# Altium schematic sheet LCT M3 SCH.SchDoc
size 559 x 498 mm
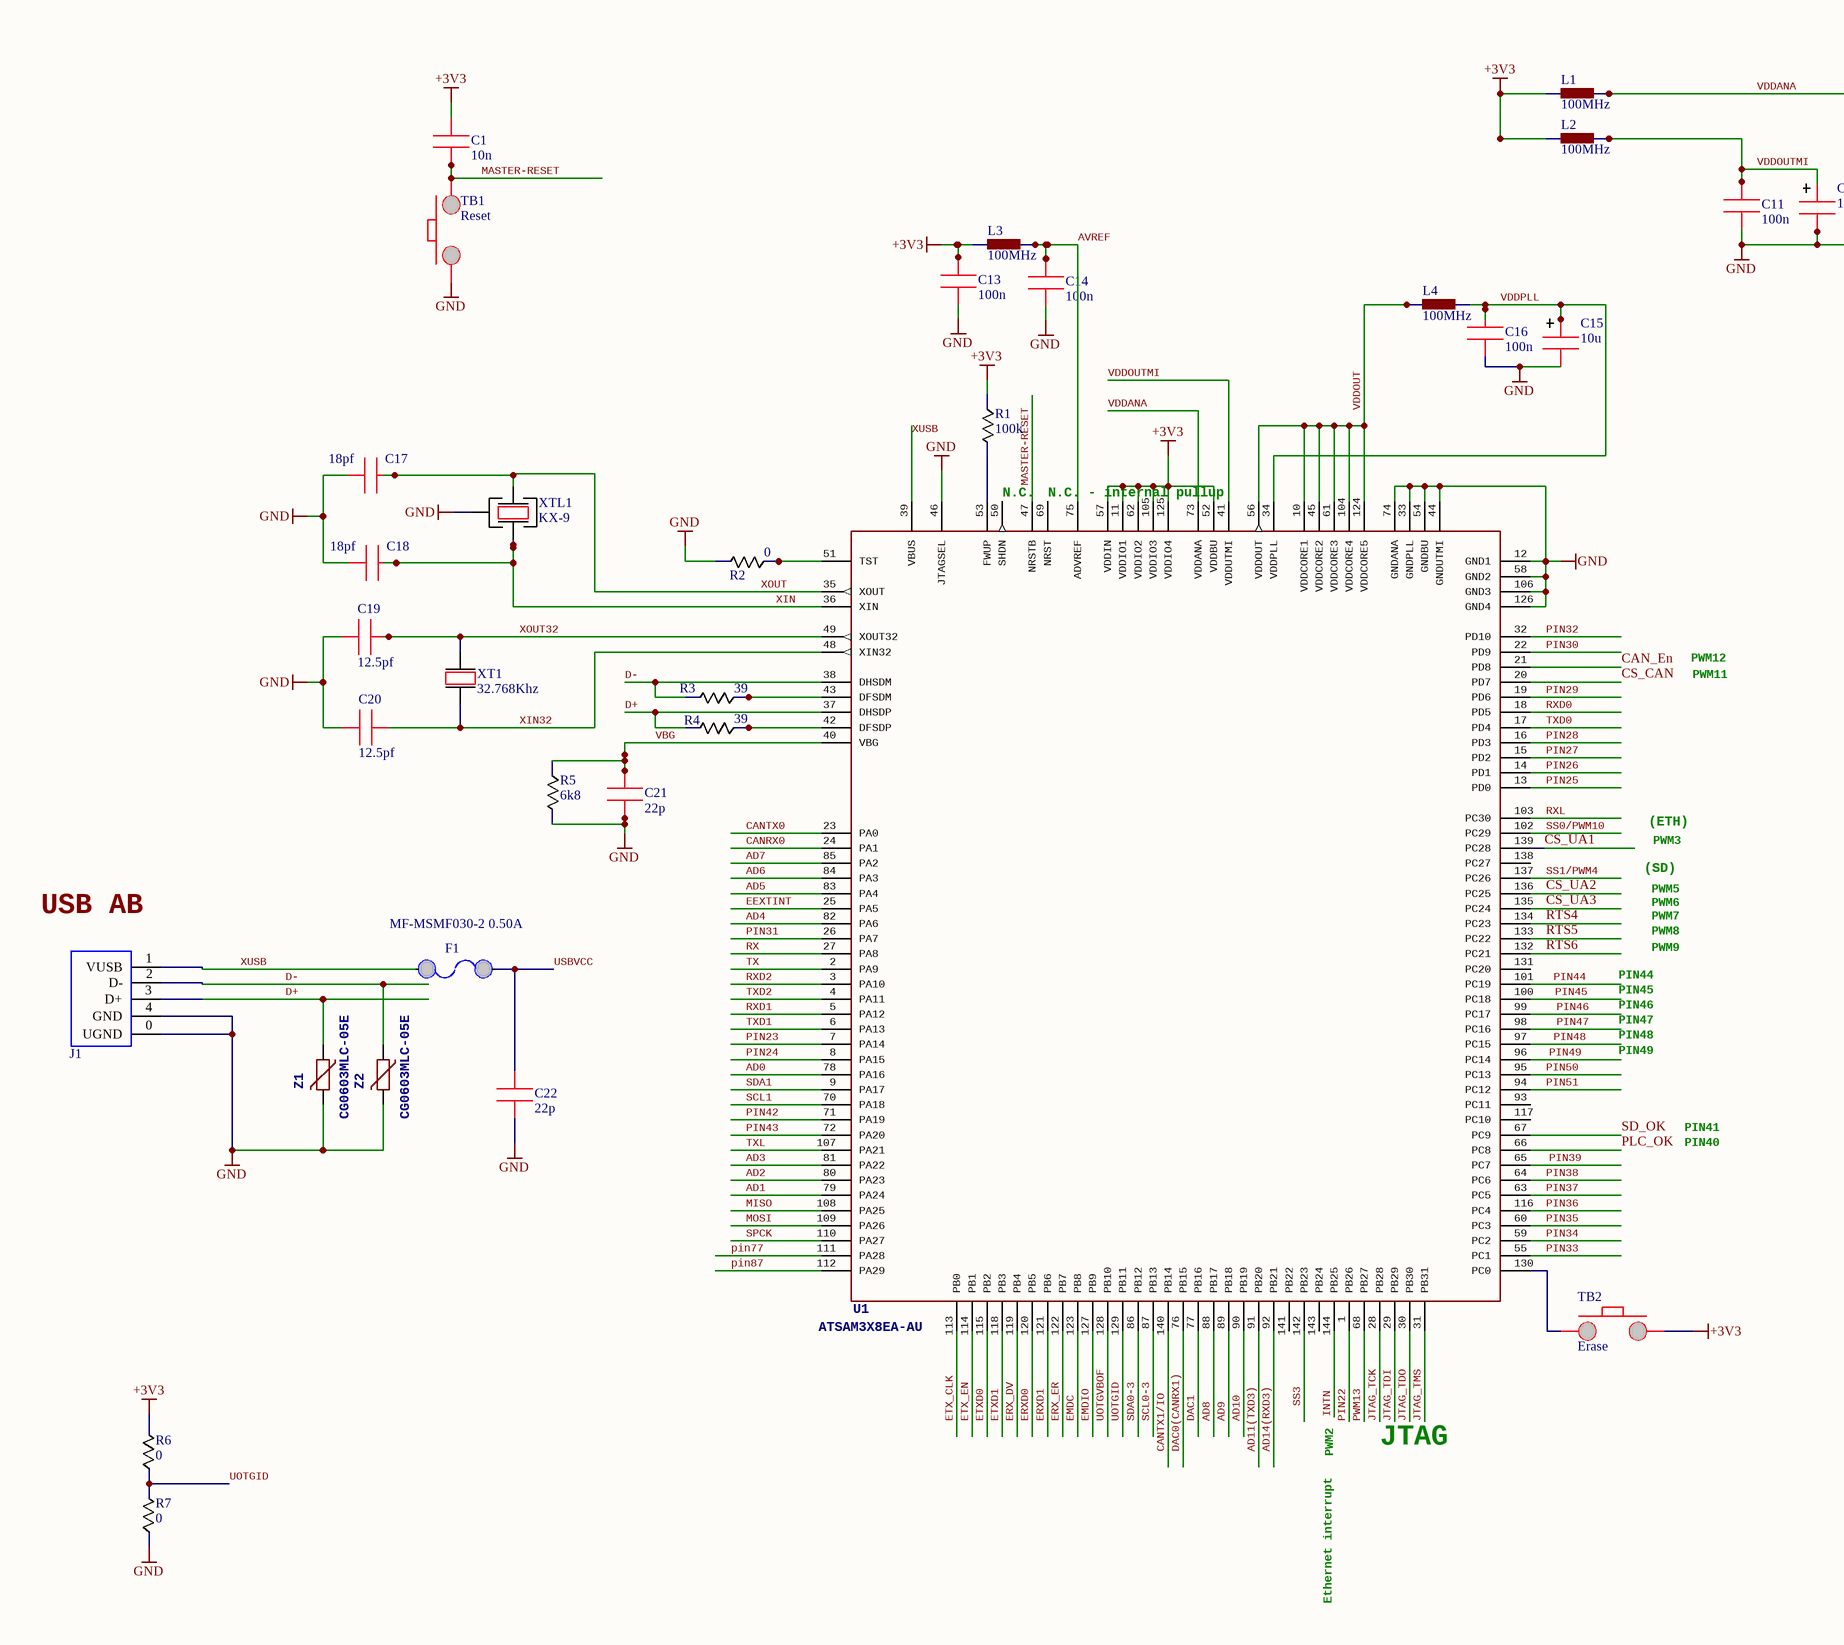
[diagram p0: LCT M3 SCH.SchDoc, left]
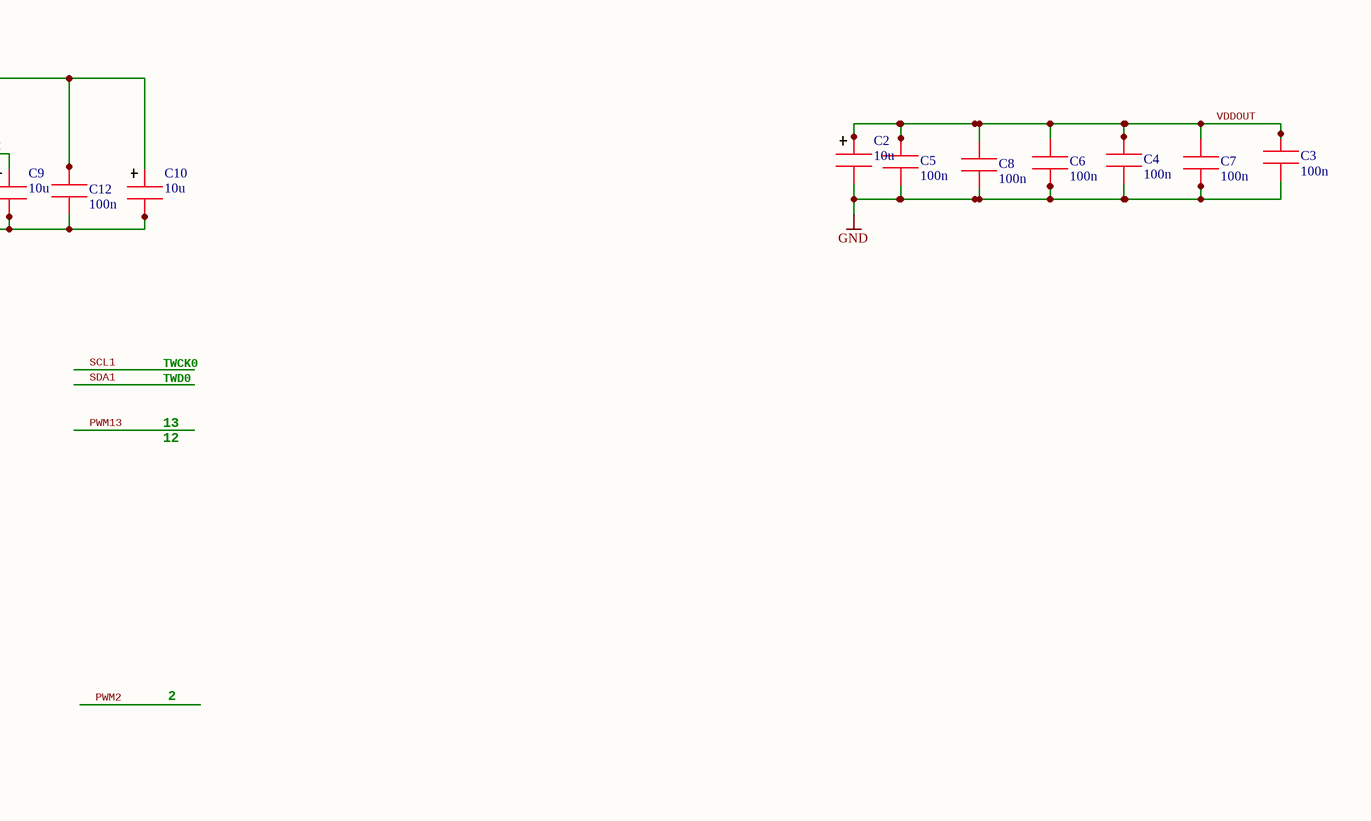
[diagram p1: LCT M3 SCH.SchDoc, right]

## Parts
C1  10n  [0603]
C2  10u  [1206]
C3  100n  [0603]
C4  100n  [0603]
C5  100n  [0603]
C6  100n  [0603]
C7  100n  [0603]
C8  100n  [0603]
C9  10u  [1206]
C10  10u  [1206]
C11  100n  [0603]
C12  100n  [0603]
C13  100n  [0603]
C14  100n  [0603]
C15  10u  [1206]
C16  100n  [0603]
C17  18pf  [0603]
C18  18pf  [0603]
C19  12.5pf  [0603]
C20  12.5pf  [0603]
C21  22p  [0603]
C22  22p  [0603]
F1  MF-MSMF030-2 0.50A  [Fuse PTS]
J1  USBB-1J  [USB B]  (value not drawn)
L1  100MHz  [0805]
L2  100MHz  [0805]
L3  100MHz  [0805]
L4  100MHz  [0805]
R1  100k  [0603]
R2  0  [0603]
R3  39  [0603]
R4  39  [0603]
R5  6k8  [0603]
R6  0  [0603]
R7  0  [0603]
TB1  Reset  [IT-1184-160G-g]
TB2  Erase  [IT-1184-160G-g]
U1  ATSAM3X8EA-AU  [LQFP144]
XT1  32.768Khz  [KX – 327]
XTL1  KX-9  [KX-9]
Z1  CG0603MLC-05E  [0603]
Z2  CG0603MLC-05E  [0603]

## Nets
+3V3: C1.2 C13.2 L1.1 L2.1 L3.1 R1.1 R6.2 TB2.1 U1.11(VDDIO1) U1.52(VDDBU) U1.57(VDDIN) U1.62(VDDIO2) U1.105(VDDIO3) U1.125(VDDIO4)
GND: C2.2 C3.1 C4.1 C5.1 C6.1 C7.1 C8.1 C9.2 C10.2 C11.1 C12.1 C13.1 C14.1 C15.2 C16.1 C17.1 C18.1 C19.2 C20.2 C21.1 C22.2 J1.0(UGND) J1.4(GND) R2.2 R5.2 R7.1 TB1.2 U1.12(GND1) U1.33(GNDPLL) U1.44(GNDUTMI) U1.46(JTAGSEL) U1.54(GNDBU) U1.58(GND2) U1.74(GNDANA) U1.106(GND3) U1.126(GND4) XTL1.g Z1.2 Z2.2
AD0: U1.78(PA16)
AD1: U1.79(PA24)
AD2: U1.80(PA23)
AD3: U1.81(PA22)
AD4: U1.82(PA6)
AD5: U1.83(PA4)
AD6: U1.84(PA3)
AD7: U1.85(PA2)
AD8: U1.88(PB17)
AD9: U1.89(PB18)
AD10: U1.90(PB19)
AD11(TXD3): U1.91(PB20)
AD14(RXD3): U1.92(PB21)
AVREF: C14.2 L3.2 U1.75(ADVREF)
CAN_En: U1.21(PD8)
CANRX0: U1.24(PA1)
CANTX0: U1.23(PA0)
CANTX1/IO: U1.140(PB14)
CS_CAN: U1.20(PD7)
CS_UA1: U1.139(PC28)
CS_UA2: U1.136(PC25)
CS_UA3: U1.135(PC24)
D+: J1.3(D+) R4.2 U1.37(DHSDP) Z1.1
D-: J1.2(D-) R3.2 U1.38(DHSDM) Z2.1
DAC0(CANRX1): U1.76(PB15)
DAC1: U1.77(PB16)
EEXTINT: U1.25(PA5)
EMDC: U1.123(PB8)
EMDIO: U1.127(PB9)
ERX_DV: U1.119(PB4)
ERX_ER: U1.122(PB7)
ERXD0: U1.120(PB5)
ERXD1: U1.121(PB6)
ETX_CLK: U1.113(PB0)
ETX_EN: U1.114(PB1)
ETXD0: U1.115(PB2)
ETXD1: U1.118(PB3)
INTN: U1.144(PB25)
JTAG_TCK: U1.28(PB28)
JTAG_TDI: U1.29(PB29)
JTAG_TDO: U1.30(PB30)
JTAG_TMS: U1.31(PB31)
MASTER-RESET: C1.1 TB1.1 U1.47(NRSTB)
MISO: U1.108(PA25)
MOSI: U1.109(PA26)
PIN22: U1.1(PB26)
PIN23: U1.7(PA14)
PIN24: U1.8(PA15)
PIN25: U1.13(PD0)
PIN26: U1.14(PD1)
PIN27: U1.15(PD2)
PIN28: U1.16(PD3)
PIN29: U1.19(PD6)
PIN30: U1.22(PD9)
PIN31: U1.26(PA7)
PIN32: U1.32(PD10)
PIN33: U1.55(PC1)
PIN34: U1.59(PC2)
PIN35: U1.60(PC3)
PIN36: U1.116(PC4)
PIN37: U1.63(PC5)
PIN38: U1.64(PC6)
PIN39: U1.65(PC7)
PIN42: U1.71(PA19)
PIN43: U1.72(PA20)
PIN44: U1.101(PC19)
PIN45: U1.100(PC18)
PIN46: U1.99(PC17)
PIN47: U1.98(PC16)
PIN48: U1.97(PC15)
PIN49: U1.96(PC14)
PIN50: U1.95(PC13)
PIN51: U1.94(PC12)
pin77: U1.111(PA28)
pin87: U1.112(PA29)
PLC_OK: U1.66(PC8)
PWM13: U1.68(PB27)
RTS4: U1.134(PC23)
RTS5: U1.133(PC22)
RTS6: U1.132(PC21)
RX: U1.27(PA8)
RXD0: U1.18(PD5)
RXD1: U1.5(PA12)
RXD2: U1.3(PA10)
RXL: U1.103(PC30)
SCL0-3: U1.87(PB13)
SCL1: U1.70(PA18)
SD_OK: U1.67(PC9)
SDA0-3: U1.86(PB12)
SDA1: U1.9(PA17)
SPCK: U1.110(PA27)
SS0/PWM10: U1.102(PC29)
SS1/PWM4: U1.137(PC26)
SS3: U1.142(PB23)
TX: U1.2(PA9)
TXD0: U1.17(PD4)
TXD1: U1.6(PA13)
TXD2: U1.4(PA11)
TXL: U1.107(PA21)
UOTGID: R6.1 R7.2 U1.129(PB11)
UOTGVBOF: U1.128(PB10)
USBVCC: C22.1 F1.1
VBG: C21.2 R5.1 U1.40(VBG)
VDDANA: C10.1 C12.2 L1.2 U1.73(VDDANA)
VDDOUT: C2.1 C3.2 C4.2 C5.2 C6.2 C7.2 C8.2 L4.1 U1.10(VDDCORE1) U1.45(VDDCORE2) U1.56(VDDOUT) U1.61(VDDCORE3) U1.104(VDDCORE4) U1.124(VDDCORE5)
VDDOUTMI: C9.1 C11.2 L2.2 U1.41(VDDUTMI)
VDDPLL: C15.1 C16.2 L4.2 U1.34(VDDPLL)
XIN: C18.2 U1.36(XIN) XTL1.3
XIN32: C20.1 U1.48(XIN32) XT1.1
XOUT: C17.2 U1.35(XOUT) XTL1.1
XOUT32: C19.1 U1.49(XOUT32) XT1.2
XUSB: F1.2 J1.1(VUSB) U1.39(VBUS)
NetR1_2: R1.2 U1.53(FWUP)
NetR2_1: R2.1 U1.51(TST)
NetR3_1: R3.1 U1.43(DFSDM)
NetR4_1: R4.1 U1.42(DFSDP)
NetTB2_2: TB2.2 U1.130(PC0)

Not connected (* = marked no-connect by the designer): U1 50(SHDN) 69(NRST) 93(PC11) 117(PC10) 131(PC20) 138(PC27) 141(PB22) 143(PB24)

## Notes on the sheet
- 13
- TWCK0
- TWD0
- N.C.
- (near U1) N.C. - internal pullup
- 12
- PWM12
- PWM11
- 2
- (SD)
- (ETH)
- PWM5
- PWM3
- (near J1) USB AB
- PWM6
- PWM7
- PWM8
- PWM9
- PIN44
- PIN46
- PIN47
- PIN48
- PIN45
- PIN49
- PIN41
- PIN40
- PWM2
- JTAG
- Ethernet interrupt

## Library data of the parts
C1 C3-C8 C11-C14 C16-C22 = Capasitor 0805
C2 C9 C10 C15 = 1206 Cap El: TAJA156K010RNJ
F1 = Fuse PTS
L1-L4 = BLM21PG220SN1D
R1-R5 = Resistor 0805: 0805 SMD Resistor
R6 R7 = Resistor 0805: RC0603FR-078K2
TB1 TB2 = IT-1184-160G-G
U1 = ATSAM3X/AAU
XT1 = KX – 327XS
Z1 Z2 = VARISTORCN0603: <b>VARISTOR</b>